# EAGLE schematic PCB 2.0.4 (EAGLE 6.5.0)
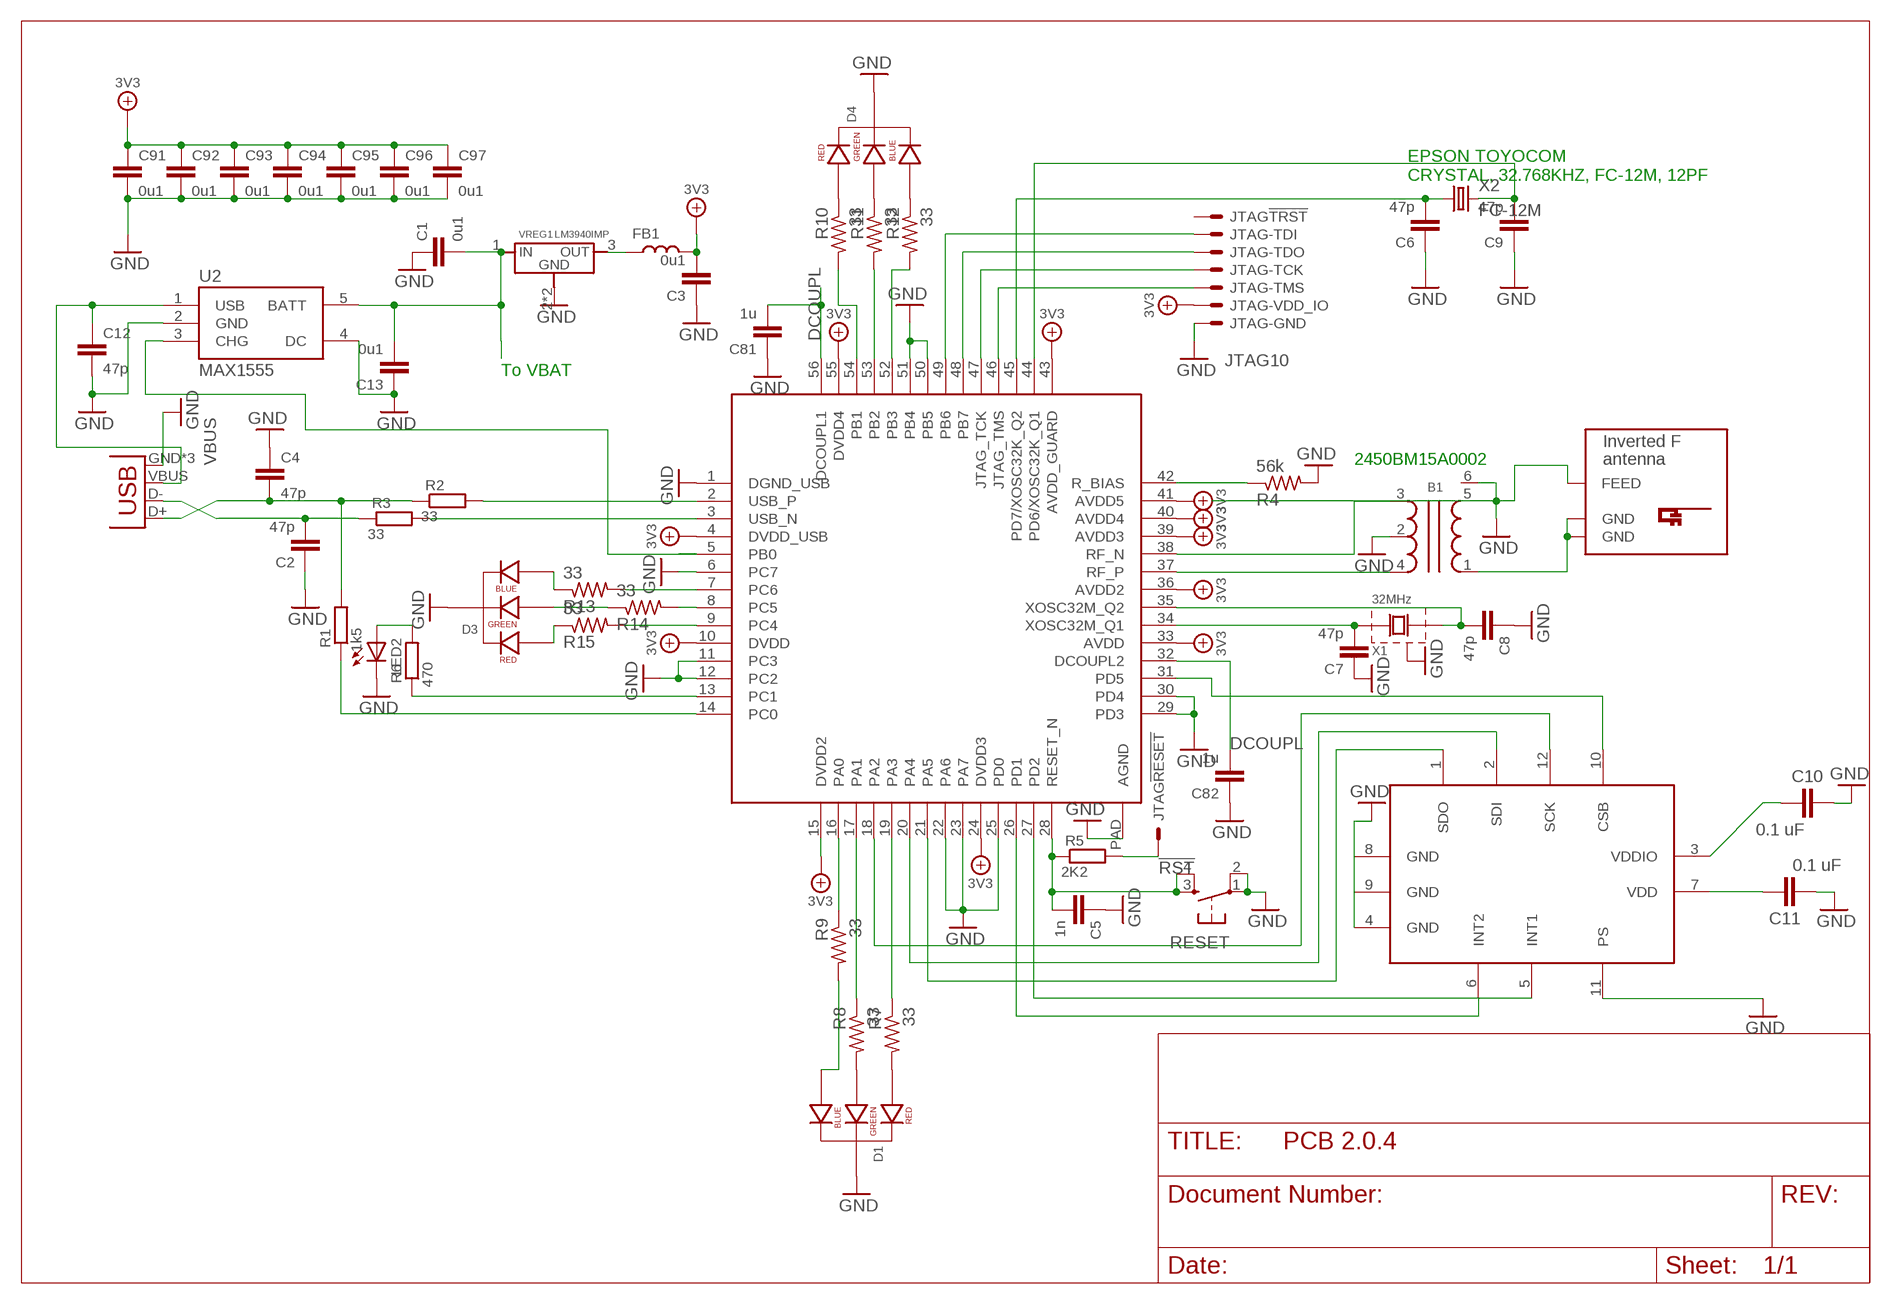
[diagram p0: schematic, sheet 1]

## Parts
B1  BALUN  [BALUN-0805]
C1  0u1  CC1206  [C1206]
C2  47p  CC0603  [C0603]
C3  0u1  CC1206  [C1206]
C4  47p  CC0603  [C0603]
C5  1n  CC0603  [C0603]
C6  47p  CC0603  [C0603]
C7  47p  CC0603  [C0603]
C8  47p  CC0603  [C0603]
C9  47p  CC0603  [C0603]
C10  0.1 uF  C-EUC0402  [C0402]
C11  0.1 uF  C-EUC0402  [C0402]
C12  47p  CC0603  [C0603]
C13  0u1  CC1206  [C1206]
C81  1u  CC0402  [C0402]
C82  1u  CC0402  [C0402]
C91  0u1  CC0402  [C0402]
C92  0u1  CC0402  [C0402]
C93  0u1  CC0402  [C0402]
C94  0u1  CC0402  [C0402]
C95  0u1  CC0402  [C0402]
C96  0u1  CC0402  [C0402]
C97  0u1  CC0402  [C0402]
D1  LED-RGB-CC-THRUCLEAR  [LED-RGB-THRU]
D3  LED-RGB-CC-THRUCLEAR  [LED-RGB-THRU]
D4  LED-RGB-CC-THRUCLEAR  [LED-RGB-THRU]
FB1  L0603  [R603]
JP1  USB-MICROB  [USB-MICROB]
JTAG  JTAG10  [HDR-2X5-2.00]
LED2  LED805  [LED-805]
R1  1k5  RR603  [R603]
R2  33  RR603  [R603]
R3  33  RR603  [R603]
R4  56k  R-US_R0402  [R0402]
R5  2K2  RR603  [R603]
R6  470  RR603  [R603]
R7  33  R-US_R0402  [R0402]
R8  33  R-US_R0402  [R0402]
R9  33  R-US_R0402  [R0402]
R10  33  R-US_R0402  [R0402]
R11  33  R-US_R0402  [R0402]
R12  33  R-US_R0402  [R0402]
R13  33  R-US_R0402  [R0402]
R14  33  R-US_R0402  [R0402]
R15  33  R-US_R0402  [R0402]
RESET  TAC_SWITCHSMD  [TACTILE_SWITCH_SMD]
U1  CC2538  [QFN56]
U2  MAX1555  [SOT23-5]
U$1  BMA250  [12LGA_VGG3-D]
U$2  INVERTED_F_ANTENNA+0  [DN007+0]
VREG1  LM3940IMP  [SOT223]
X1  32MHz  XTAL-43225  [XTAL-4-3225]
X2  FC-12M  [FC-12M]

## Nets
3V3: C3.2 C91.1 C92.1 C93.1 C94.1 C95.1 C96.1 C97.1 FB1.2 JTAG.1 JTAG.2 U1.4(DVDD_USB) U1.10(DVDD) U1.15(DVDD2) U1.24(DVDD3) U1.33(AVDD) U1.36(AVDD2) U1.39(AVDD3) U1.40(AVDD4) U1.41(AVDD5) U1.43(AVDD_GUARD) U1.55(DVDD4)
!RST: JTAG.4 R5.2
!RST_PIN: C5.2 R5.1 RESET.3 RESET.4 U1.28(RESET_N)
CN1: C4.2 JP1.D+ R1.2 R2.1
DCOUPL: C81.2 C82.2 U1.32(DCOUPL2) U1.56(DCOUPL1)
GND: B1.2 B1.5 B1.6 C1.1 C2.1 C3.1 C4.1 C5.1 C6.1 C7.1 C8.1 C9.1 C10.1 C11.2 C12.2 C13.1 C81.1 C82.1 C91.2 C92.2 C93.2 C94.2 C95.2 C96.2 C97.2 D1.2(CATHODE) D3.2(CATHODE) D4.2(CATHODE) JP1.GND JP1.MT1(GND) JP1.MT2(GND) JTAG.8 JTAG.10 LED2.C R4.2 RESET.1 RESET.2 U1.1(DGND_USB) U1.6(PC7) U1.11(PC3) U1.12(PC2) U1.22(PA6) U1.23(PA7) U1.25(PD0) U1.29(PD3) U1.30(PD4) U1.50(PB5) U1.51(PB4) U1.PAD(AGND) U2.2(GND) U2.4(DC) U$1.4(GND) U$1.8(GND) U$1.9(GND) U$1.11(PS) U$2.FEED VREG1.2(GND) VREG1.4(GND) X1.2(GND1) X1.4(GND1)
N$1: R2.2 U1.2(USB_P)
N$2: R3.2 U1.3(USB_N)
N$3: D1.1(RED_CATHODE) R7.2
N$4: R1.1 U1.14(PC0)
N$5: R4.1 U1.42(R_BIAS)
N$6: JTAG.9 U1.47(JTAG_TCK)
N$7: JTAG.7 U1.46(JTAG_TMS)
N$8: U1.27(PD2) U$1.5(INT1)
N$9: U1.26(PD1) U$1.6(INT2)
N$10: U1.21(PA5) U$1.1(SDO)
N$11: U1.18(PA2) U$1.12(SCK)
N$12: C2.2 JP1.D- R3.1
N$13: U1.31(PD5) U$1.10(CSB)
N$14: C1.2 C13.2 U2.5(BATT) VREG1.1(IN)
N$15: U1.20(PA4) U$1.2(SDI)
N$16: D1.3(GREEN_CATHODE) R8.2
N$17: FB1.1 VREG1.3(OUT)
N$18: D1.4(BLUE_CATHODE) R9.2
N$19: R10.2 U1.54(PB1)
N$20: R11.2 U1.53(PB2)
N$21: U1.5(PB0) U2.3(CHG)
N$22: R12.2 U1.52(PB3)
N$23: C6.2 U1.45(PD7/XOSC32K_Q2) X2.1
N$24: D4.1(RED_CATHODE) R10.1
N$25: D3.4(BLUE_CATHODE) R13.1
N$26: D3.1(RED_CATHODE) R15.1
N$27: B1.3 U1.38(RF_N)
N$28: B1.4 U1.37(RF_P)
N$29: D4.3(GREEN_CATHODE) R11.1
N$30: C8.2 U1.35(XOSC32M_Q2) X1.3(X2)
N$31: C7.2 U1.34(XOSC32M_Q1) X1.1(X1)
N$32: D4.4(BLUE_CATHODE) R12.1
N$33: R15.2 U1.9(PC4)
N$34: R14.2 U1.8(PC5)
N$35: D3.3(GREEN_CATHODE) R14.1
N$36: R13.2 U1.7(PC6)
N$37: R9.1 U1.16(PA0)
N$38: R8.1 U1.17(PA1)
N$39: R7.1 U1.19(PA3)
N$40: C9.2 U1.44(PD6/XOSC32K_Q1) X2.2
N$44: R6.1 U1.13(PC1)
N$45: LED2.A R6.2
PB6: JTAG.5 U1.49(PB6)
PB7: JTAG.6 U1.48(PB7)
RF: B1.1 U$2.GND U$2.GND@1(GND)
VBUS: C12.1 JP1.VBUS U2.1(USB)
VDD: C11.1 U$1.7(VDD)
VDDIO: C10.2 U$1.3(VDDIO)
Unconnected: JTAG.3

## Notes on the sheet
- EPSON TOYOCOM
  CRYSTAL, 32.768KHZ, FC-12M, 12PF
- To VBAT
- 2450BM15A0002

## Library data of the parts
B1 = discrete:BALUN
C1-C9 C12 C13 C81 C82 C91-C97 = discrete:C: CAPACITOR, European symbol
C10 C11 = resistor:C-EU: CAPACITOR, European symbol
D1 D3 D4 = SparkFun-LED:LED-RGB-CC-THRU: RGB Through-hole common cathode LED SparkFun Storefront: COM-00105 (Clear) COM-09264 (Diffuse); PROD_ID: DIO-08418
FB1 = discrete:L
JP1 = SparkFun-Connectors:USB: USB Connectors USB-B-PTH is fully proven SKU : PRT-00139/CONN-08278 USB-miniB is fully proven SKU : PRT-00587 USB-A-PCB is untested. USB-A-H is throughly reviewed, but untested. Spark Fun Electronics SKU : PRT-00437 USB-B-SMT is throughly reviewed, but untested. Needs silkscreen touching up. USB-A-S has not been used/tested USB-MB-H has not been used/tested USB-MICROB has been used. CONN-09505; PROD_ID: CONN-09505
JTAG = jtag:JTAG10
LED2 = discrete:LED
R1-R3 R5 R6 = discrete:R
R4 R7-R15 = rcl:R-US_: RESISTOR, American symbol
RESET = SparkFun-Electromechanical:TAC_SWITCH: Momentary Switch Button commonly used for reset or general input. Spark Fun Electronics SKU : COM-00097 SMT- SWCH-08247; PROD_ID: SWCH-08247
U1 = ic:CC2538
U2 = SparkFun-PowerIC:MAX1555: MAX1555 Lithium Charger IC SOT-23 Lithium Polymer charging IC. Schematic element and footprint proven. Spark Fun Electronics SKU : COM-00674
U$1 = DSSCircuits:BMA250
U$2 = antenna:INVERTED_F_ANTENNA: 2.4GHz Inverted F Antenna Based on TI Design Note DN007
VREG1 = voltage-regulators:LM3940
X1 = discrete:XTAL-4
X2 = crystal:FC-12M: kHz RANGE CRYSTAL UNIT LOW PROFILE SMD Source: Epson Toyocom FC-12M.pdf

## Net classes
0 default: width 0.152 mm, drill 0.305 mm, clearance 0.152 mm
1 RF: width 0.152 mm, clearance 0.152 mm